# Altium schematic sheet STM32F103RBT6.SchDoc
size A4
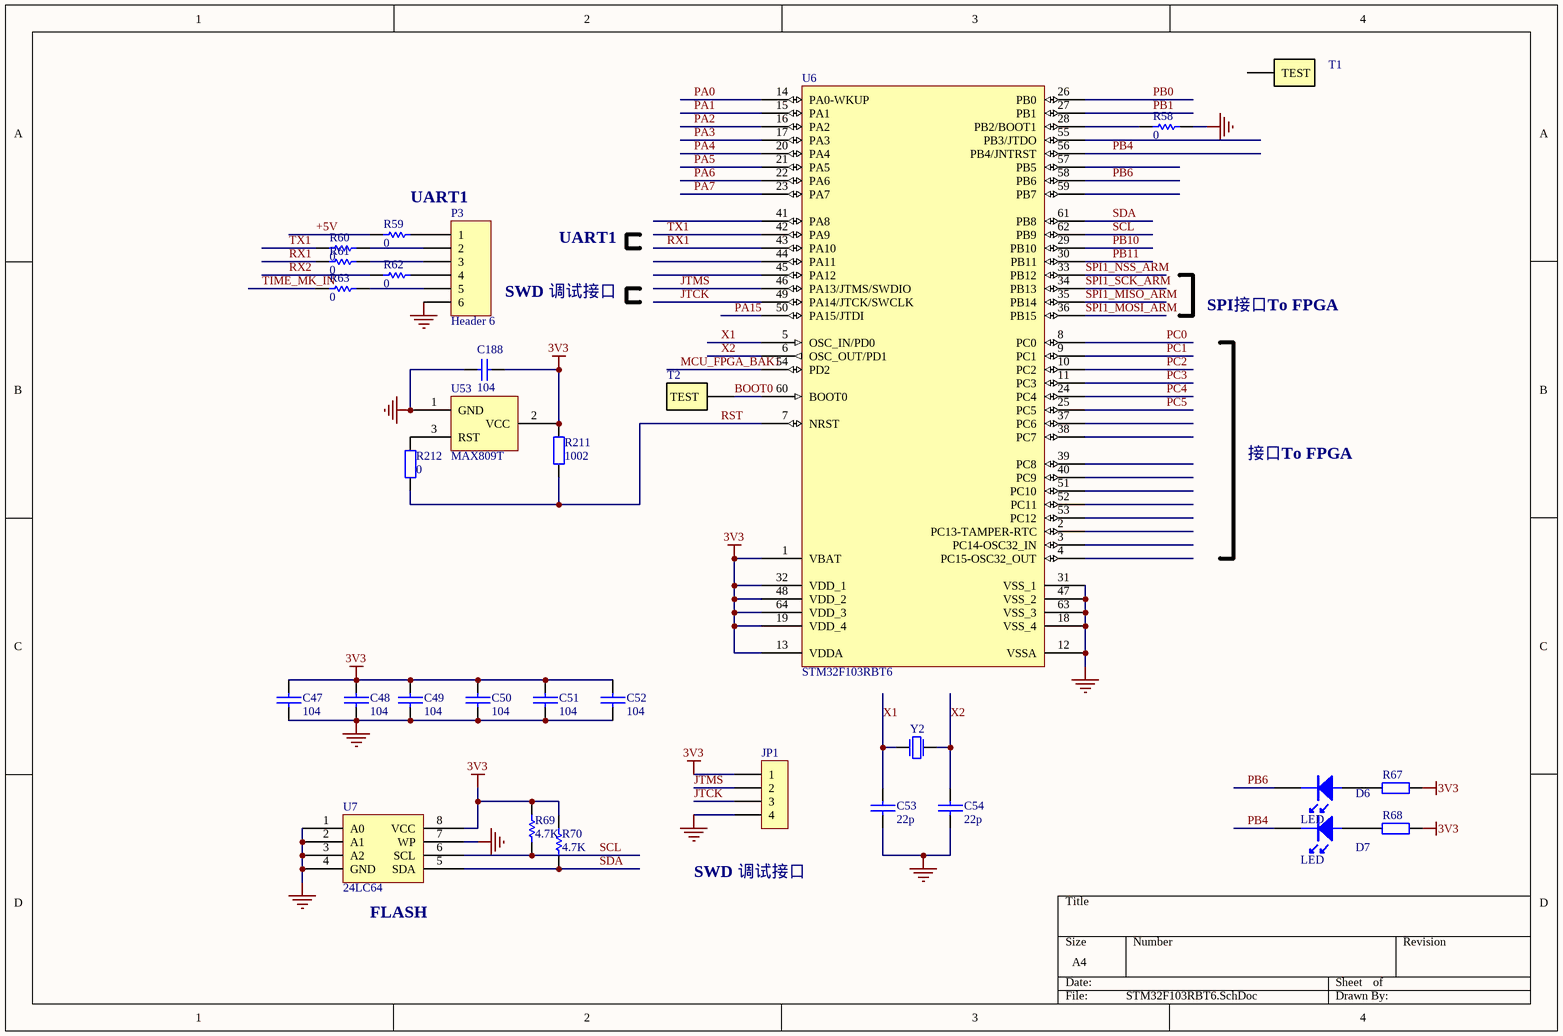
[diagram p0: STM32F103RBT6.SchDoc]

## Parts
C47  104  [0805C]
C48  104  [0805C]
C49  104  [0805C]
C50  104  [0805C]
C51  104  [0805C]
C52  104  [0805C]
C53  22p  [0805C]
C54  22p  [0805C]
C188  104  [0805C]
D6  LED  [0805_LED]
D7  LED  [0805_LED]
JP1  (no value)  [HDR1X4]
P3  Header 6  [HDR1X6]
R58  0  [0805R]
R59  0  [0805R]
R60  0  [0805R]
R61  0  [0805R]
R62  0  [0805R]
R63  0  [0805R]
R67  4701  [0805R]  (value not drawn)
R68  4701  [0805R]  (value not drawn)
R69  4.7K  [0805R]
R70  4.7K  [0805R]
R211  1002  [0805R]
R212  0  [0805R]
T1  (no value)  [TEST]
T2  (no value)  [TEST]
U6  STM32F103RBT6  [LQFP64_M]
U7  24LC64  [SO8]
U53  MAX809T  [MAX809-SOT23]
Y2  (no value)  [XTAL_8M]

## Nets
3V3: C47.1 C48.1 C49.1 C50.1 C51.1 C52.1 C188.1 JP1.1 R67.2 R68.2 R69.2 R70.2 R211.1 U6.1(VBAT) U6.13(VDDA) U6.19(VDD_4) U6.32(VDD_1) U6.48(VDD_2) U6.64(VDD_3) U7.8(VCC) U53.2(VCC)
GND: C47.2 C48.2 C49.2 C50.2 C51.2 C52.2 C53.2 C54.2 C188.2 JP1.4 P3.6 R58.2 U6.12(VSSA) U6.18(VSS_4) U6.31(VSS_1) U6.47(VSS_2) U6.63(VSS_3) U7.1(A0) U7.2(A1) U7.3(A2) U7.4(GND) U7.7(WP) U53.1(GND)
+5V: R59.1
BOOT0: T2.1(TEST) U6.60(BOOT0)
JTCK: JP1.3 U6.49(PA14/JTCK/SWCLK)
JTMS: JP1.2 U6.46(PA13/JTMS/SWDIO)
MCU_FPGA_BAK1: U6.54(PD2)
PA0: U6.14(PA0-WKUP)
PA1: U6.15(PA1)
PA2: U6.16(PA2)
PA3: U6.17(PA3)
PA4: U6.20(PA4)
PA5: U6.21(PA5)
PA6: U6.22(PA6)
PA7: U6.23(PA7)
PA15: U6.50(PA15/JTDI)
PB0: U6.26(PB0)
PB1: U6.27(PB1)
PB4: D7.2(K) U6.56(PB4/JNTRST)
PB6: D6.2(K) U6.58(PB6)
PB10: U6.29(PB10)
PB11: U6.30(PB11)
PC0: U6.8(PC0)
PC1: U6.9(PC1)
PC2: U6.10(PC2)
PC3: U6.11(PC3)
PC4: U6.24(PC4)
PC5: U6.25(PC5)
RST: R211.2 R212.2 U6.7(NRST)
RX1: R61.1 U6.43(PA10)
RX2: R62.1
SCL: R69.1 U6.62(PB9) U7.6(SCL)
SDA: R70.1 U6.61(PB8) U7.5(SDA)
SPI1_MISO_ARM: U6.35(PB14)
SPI1_MOSI_ARM: U6.36(PB15)
SPI1_NSS_ARM: U6.33(PB12)
SPI1_SCK_ARM: U6.34(PB13)
TIME_MK_IN: R63.1
TX1: R60.1 U6.42(PA9)
X1: C53.1 U6.5(OSC_IN/PD0) Y2.2(P2)
X2: C54.1 U6.6(OSC_OUT/PD1) Y2.1(P1)
NetD6_1: D6.1(A) R67.1
NetD7_1: D7.1(A) R68.1
NetP3_1: P3.1 R59.2
NetP3_2: P3.2 R60.2
NetP3_3: P3.3 R61.2
NetP3_4: P3.4 R62.2
NetP3_5: P3.5 R63.2
NetR58_1: R58.1 U6.28(PB2/BOOT1)
NetR212_1: R212.1 U53.3(RST)

Not connected (* = marked no-connect by the designer): T1 1(TEST); U6 2(PC13-TAMPER-RTC) 3(PC14-OSC32_IN) 4(PC15-OSC32_OUT) 37(PC6) 38(PC7) 39(PC8) 40(PC9) 41(PA8) 44(PA11) 45(PA12) 51(PC10) 52(PC11) 53(PC12) 55(PB3/JTDO) 57(PB5) 59(PB7)

## Notes on the sheet
- UART1
- SWD 调试接口
- SPI接口To FPGA
- 接口To FPGA
- (near U7) FLASH
- (near JP1) SWD 调试接口

## Library data of the parts
C47-C54 = CAP: Capacitor
C188 = Cap: Capacitor; Published: 8-Jun-2000; LatestRevisionDate: 17-Jul-2002; LatestRevisionNote: Re-released for DXP Platform.; PackageReference: RAD-0.3; Publisher: Altium Limited; Value: 104
JP1 = CON4: Connector
P3 = Header 6: Header, 6-Pin; LatestRevisionDate: 17-Jul-2002; LatestRevisionNote: Re-released for DXP Platform.; Publisher: Altium Limited
R58-R63 R69 R70 = Res1: Resistor; Published: *; Revision: *; Publisher: *; Value: *
R67 R68 = Res2: Resistor; Value: 5K; Published: 8-Jun-2000; LatestRevisionDate: 17-Jul-2002; LatestRevisionNote: Re-released for DXP Platform.; PackageReference: AXIAL-0.4; Publisher: Altium Limited
R211 = Res2: Resistor; Value: 10K; Published: 8-Jun-2000; LatestRevisionDate: 17-Jul-2002; LatestRevisionNote: Re-released for DXP Platform.; PackageReference: AXIAL-0.4; Publisher: Altium Limited
R212 = Res2: Resistor; Value: 330R; Published: 8-Jun-2000; LatestRevisionDate: 17-Jul-2002; LatestRevisionNote: Re-released for DXP Platform.; PackageReference: AXIAL-0.4; Publisher: Altium Limited
T1 T2 = TEST
U6 = STM32F103RBT6: STM32 ARM-based 32-bit MCU with 128 Kbytes Flash, 64-pin LQFP, Industrial Temperature; Published: *; DatasheetVersion: *; PackageVersion: *; PackageReference: *; Publisher: *; PackageDescription: *; ComponentLink1Description: *; ComponentLink1URL: *; ComponentLink2Description: *; ComponentLink2URL: *
U7 = 24C02
Y2 = XTAL: Crystal Oscillator